# Altium schematic sheet [Slave]STM32F405RGT6.SchDoc: AC
size A4; Author: Nguyen Huu Nghia; CompanyName: MAT; Organization: AD20; Address1: x; Address2: x; Address3: x; Address4: x; DocumentNumber: 1; Revision: V1.0; SheetNumber: 1; SheetTotal: 1
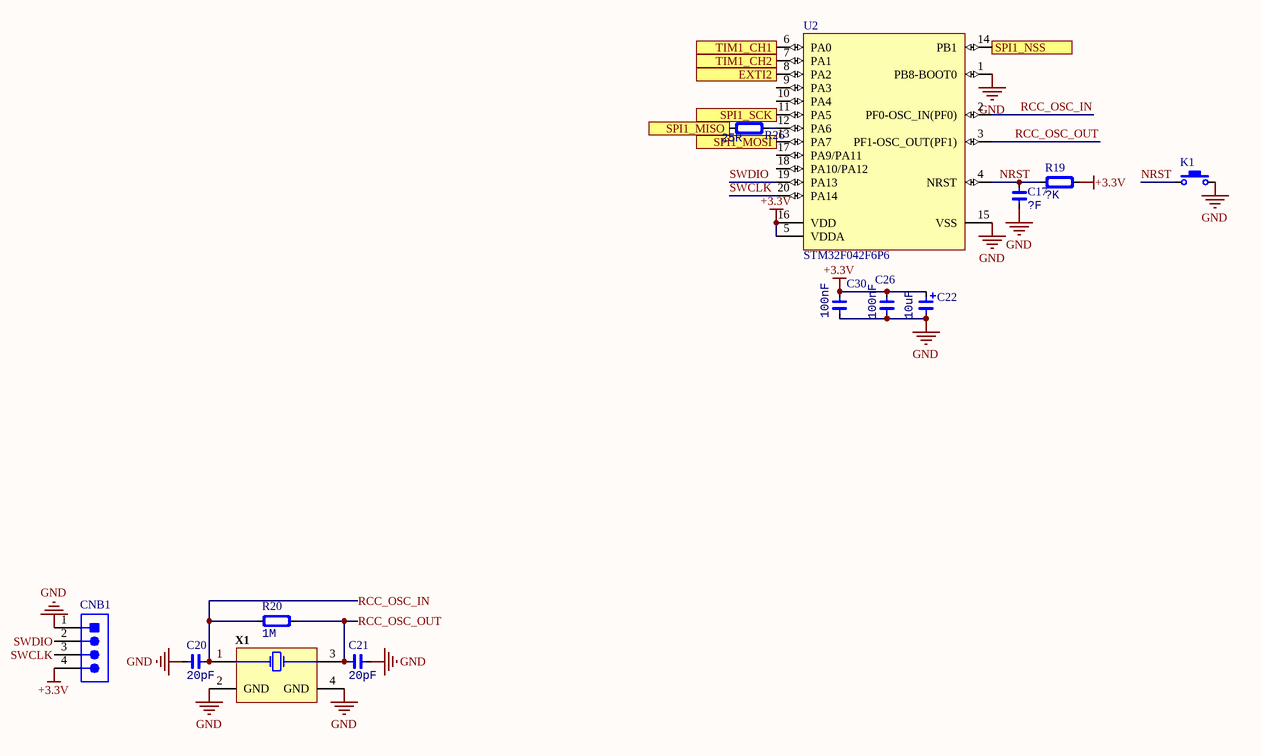
[diagram p0: [Slave]STM32F405RGT6.SchDoc]

## Parts
C17  value ?F  [CAP-0603]  (hidden comment: Cap_0603)
C20  value 20pF  [CAP-0603]  (hidden comment: Cap_0603)
C21  value 20pF  [CAP-0603]  (hidden comment: Cap_0603)
C22  value 10uF  [CAP_TAN_1206]  (hidden comment: C1206)
C26  value 100nF  [CAP-0603]  (hidden comment: Cap_0603)
C30  value 100nF  [CAP-0603]  (hidden comment: Cap_0603)
CNB1  B4B-EH-A(LF)(SN)  [JST-B4B-EH-A_V]  (value not drawn)
K1  TACT  [ButtonTACT_3x4x2_180]  (value not drawn)
R19  value ?K  [RES-0603]  (hidden comment: R0603)
R20  value 1M  [RES-0603]  (hidden comment: Res_0603)
R26  value 25R  [RES-0805]  (hidden comment: Res_0805)
U2  STM32F042F6P6  [STM-TSSOP20_M]
X1  7B-12.288MAAJ-T  [TXC-7B-4_V]  (value not drawn)

## Ports
EXTI2 (in), SPI1_MISO, SPI1_MOSI (in), SPI1_NSS (in), SPI1_SCK (in), TIM1_CH1 (in), TIM1_CH2 (in)

## Nets
+3.3V: C22.1 C26.2 C30.2 CNB1.4 R19.2 U2.5(VDDA) U2.16(VDD)
GND: C17.1 C20.2 C21.1 C22.2 C26.1 C30.1 CNB1.1 K1.2 U2.1(PB8-BOOT0) U2.15(VSS) X1.2(GND) X1.4(GND)
EXTI2: U2.8(PA2) ; port EXTI2
NRST: C17.2 K1.1 R19.1 U2.4(NRST)
RCC_OSC_IN: C20.1 R20.1 U2.2(PF0-OSC_IN(PF0)) X1.1(X1)
RCC_OSC_OUT: C21.2 R20.2 U2.3(PF1-OSC_OUT(PF1)) X1.3(X2)
SPI1_MISO: R26.1 ; port SPI1_MISO
SPI1_MOSI: U2.13(PA7) ; port SPI1_MOSI
SPI1_NSS: U2.14(PB1) ; port SPI1_NSS
SPI1_SCK: U2.11(PA5) ; port SPI1_SCK
SWCLK: CNB1.3 U2.20(PA14)
SWDIO: CNB1.2 U2.19(PA13)
TIM1_CH1: U2.6(PA0) ; port TIM1_CH1
TIM1_CH2: U2.7(PA1) ; port TIM1_CH2
NetR26_2: R26.2 U2.12(PA6)

Not connected (* = marked no-connect by the designer): U2 9(PA3) 10(PA4) 17(PA9/PA11) 18(PA10/PA12)

## Notes on the sheet
- Title
- Size:
- Date:
- A4
- Number:
- Time:
- Revision:
- Sheet
- of
- File:

## Library data of the parts
C17 C20 C21 C26 C30 = Cap_0603: Capacitor; Manufacturer: *
  C17 C26 C30: Note: *
C22 = Cap_Tan_1206: Capacitor Tantalum; Manufacturer: *; Note: *
CNB1 = CMP-2000-05904-1: Male Header, Pitch 2.5 mm, 1 x 4 Position, Height 6 mm, Tail Length 3.2 mm, -25 to 85 degC, RoHS, Bulk; Manufacturer: JST; Style/Orientation: StraightHeader/Plug; Pitch: 2.5mm; No of Positions: 4; Mounting Technology: SurfaceMount; Package Description: Male Header, Pitch 2.5 mm, 1 x 4 Position, Height 6 mm, Tail Length 3.2 mm; Datasheet Version: 12/2012; Type: ShroudedHeader; Package Reference: B4B-EH-A; Manufacturer URL: http://www.jst.com/home2.html; Termination: Crimp; Datasheet URL: http://www.jst-mfg.com/product/pdf/eng/eEH.pdf
K1 = ButtonTACT_180_3x4x2: Button; value: 3x4mm; type: TACT 2P
R19 = Res_0603: Resistor; Manufacturer: *; Note: *
R20 = Res_0603: Resistor; Specification: ±1%; Manufacturer: *; Note: *
R26 = Res_0805: Resistor; Specification: ±1%; Manufacturer: *; Note: *
U2 = CMP-0304-00108-2: ARM Cortex-M0 32-bit MCU, 32 KB Flash, 6 KB Internal RAM, 16 I/Os, 20-Pin TSSOP, -40 to 85 degC, Tube; Manufacturer: STMicroelectronics; Package Description: 20-Pin Thin Shrink Small Outline Package, Body 6.5 x 4.4 mm, Pitch 0.65 mm; ComponentLink1URL: http://www.st.com/; ComponentLink2Description: Datasheet; Package Reference: TSSOP20; ComponentLink2URL: http://www.st.com/st-web-ui/static/active/en/resource/technical/document/datasheet/DM00105814.pdf; ComponentLink1Description: Manufacturer URL; Mounting Technology: Surface Mount; Core: ARM Cortex-M0; PartNumber: STM32F042F6P6; DatasheetVersion: Rev. 5
X1 = CMP-1774-00006-1: SMD Seam Sealing Crystal, 12.288 MHz, +/- 30 ppm, 18 pF, -10 to 70 degC, 4-Pin SMD, RoHS, Tape and Reel; Forward Current: 200 mA; Peak Reverse Current: 2 uA; Max Surge Current: 600 mA; Case\Package: SOT-23; Elements: 2; Recovery Time: 5 ns; Forward Voltage: 800 mV; Mount: Surface Mount; Min Operating Temperature: -55 degC; Height: 0.93 mm; RoHSCompliant: true; PackageDescription: 4-Pin Surface Mount Device, Body 5 x 3.2 mm, Pitch 3.7 mm; ComponentLink1Description: Datasheet; REACH SVHC: No SVHC; Packaging: Tape and Reel; ComponentLink1URL: http://www.txccorp.com/download/products/quartz_crystals/2015TXC_7B_19.pdf; Pins: 3; Width: 1.3 mm; DatasheetVersion: Jul-15; Max Operating Temperature: 150 degC; Radiation Hardening: No; Package Quantity: 3000; PackageReference: 7B-4; Length: 2.92 mm